# Altium schematic sheet Analogue_Audio.SchDoc: Apalis Evaluation Board 1.1
size A3; Organization: Toradex AG; Address1: Altsagenstrasse 5; Address2: Horw; Address3: 6048; Address4: Switzerland; DocumentNumber: 14; Revision: V1.1; SheetNumber: 14; SheetTotal: 32; PageSetup: Record=PageOptions|CenterHorizontal=True|CenterVertical=True|PrintScale=0.73|XCorrection=1.00|YCorrection=1.00|PrintKind=0|BorderSize=5000000|LeftOffset=0|BottomOffset=0|Orientation=2|PaperLength=1000|PaperWidth=1000|Scale=100|PaperSource=7|PrintQuality=-4|MediaType=1|DitherType=10|PaperKind=A4|PrintScaleMode=1
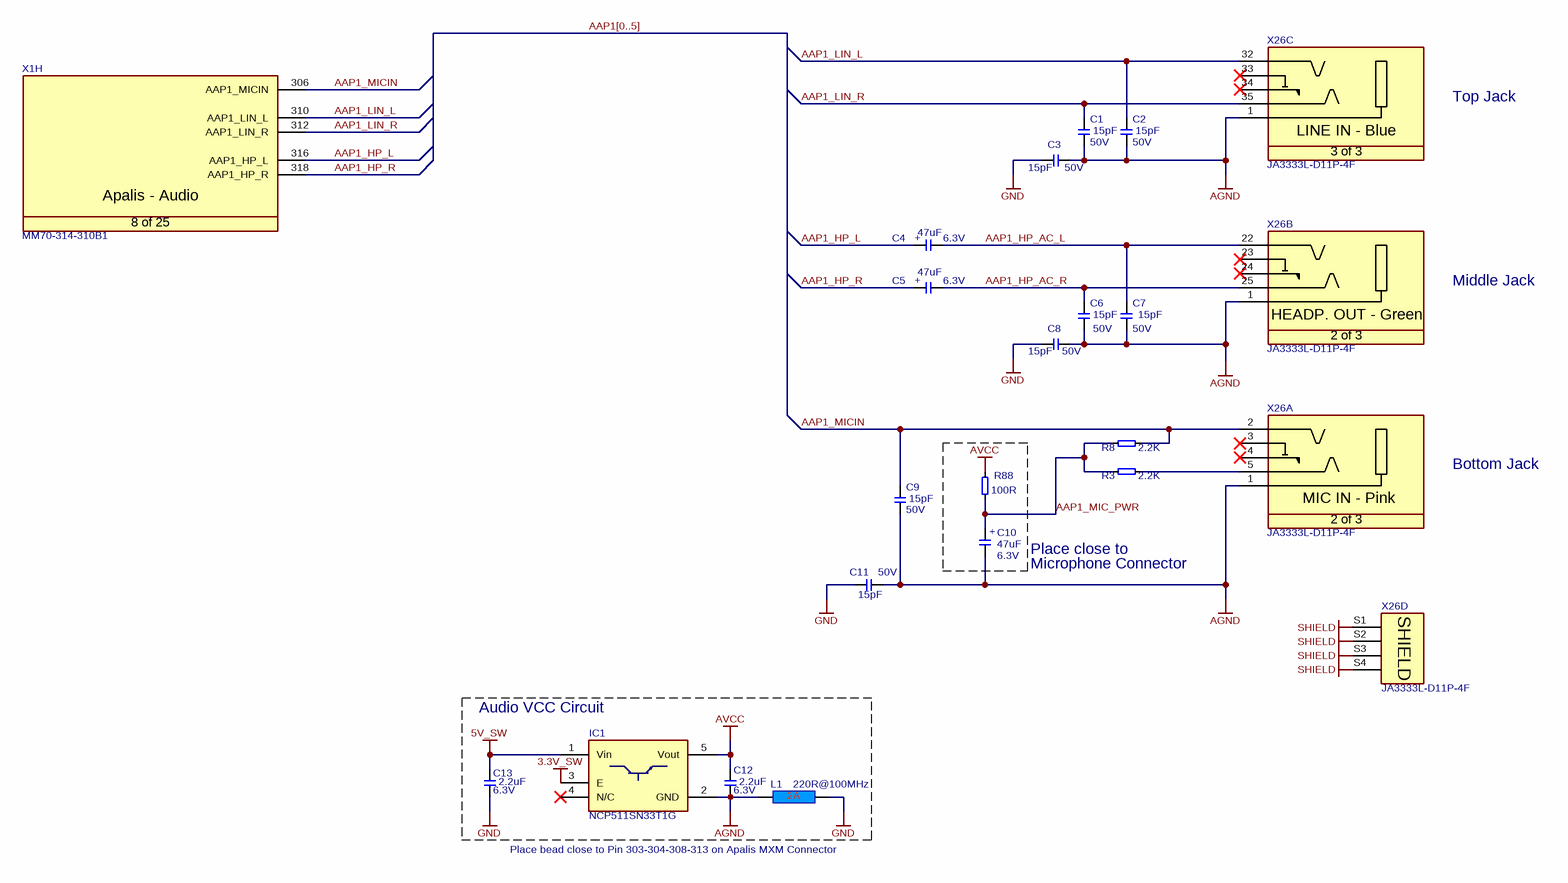
[diagram p0: Analogue_Audio.SchDoc]

## Parts
C1  Rating: 50V  [T_CAPC0603X33N]  (hidden comment: 15pF)
C2  Rating: 50V  [T_CAPC0603X33N]  (hidden comment: 15pF)
C3  Rating: 50V  [T_CAPC0603X33N]  (hidden comment: 15pF)
C4  Rating: 6.3V  [T_CAPMP3216X180N]  (hidden comment: 47uF)
C5  Rating: 6.3V  [T_CAPMP3216X180N]  (hidden comment: 47uF)
C6  Rating: 50V  [T_CAPC0603X33N]  (hidden comment: 15pF)
C7  Rating: 50V  [T_CAPC0603X33N]  (hidden comment: 15pF)
C8  Rating: 50V  [T_CAPC0603X33N]  (hidden comment: 15pF)
C9  Rating: 50V  [T_CAPC0603X33N]  (hidden comment: 15pF)
C10  Rating: 6.3V  [T_CAPMP3216X180N]  (hidden comment: 47uF)
C11  Rating: 50V  [T_CAPC0603X33N]  (hidden comment: 15pF)
C12  Rating: 6.3V  [T_CAPC0603X33N]  (hidden comment: 2.2uF)
C13  Rating: 6.3V  [T_CAPC0603X33N]  (hidden comment: 2.2uF)
IC1  NCP511SN33T1G  [SOT95P279X142-5N]
L1  220R@100MHz  [INDC1608X95N]
R3  2.2K  [T_RESC0603X30N]
R8  2.2K  [T_RESC0603X30N]
R88  100R  [T_RESC0603X30N]
X1  Manufacturer Part No.: MM70-314-310B1  [T_JAE_MM70-314-310B1]  (hidden comment: CON-JAE-MM70-314-310B1-314-0.5mm)  (part H of 25)
X26  JA3333L-D11P-4F  [T_FOXCONN_JA3333L-D11P-4F]  (parts A,B,C,D of 4)

## Blocks framed on the sheet
Audio VCC Circuit: C12 C13 IC1 L1

## Nets
3.3V_SW: IC1.3(E)
5V_SW: C13.2 IC1.1(Vin)
AGND: C1.1 C2.1 C3.2 C6.1 C7.1 C8.2 C9.1 C10.2 C11.1 C12.1 IC1.2(GND) L1.1 X26.1
AVCC: C12.2 IC1.5(Vout) R88.2
GND: C3.1 C8.1 C11.2 C13.1 L1.2
SHIELD: X26.S1(SHIELD) X26.S2(SHIELD) X26.S3(SHIELD) X26.S4(SHIELD)
AAP1_HP_AC_L: C4.2 C7.2 X26.22
AAP1_HP_AC_R: C5.2 C6.2 X26.25
AAP1_HP_L: C4.1 X1.316(AAP1_HP_L)
AAP1_HP_R: C5.1 X1.318(AAP1_HP_R)
AAP1_LIN_L: C2.2 X1.310(AAP1_LIN_L) X26.32
AAP1_LIN_R: C1.2 X1.312(AAP1_LIN_R) X26.35
AAP1_MIC_PWR: C10.1 R3.1 R8.1 R88.1
AAP1_MICIN: C9.2 R8.2 X1.306(AAP1_MICIN) X26.2
NetR3_2: R3.2 X26.5

Not connected (* = marked no-connect by the designer): IC1 4(N/C)*; X26 3* 4* 23* 24* 33* 34*

## Buses and harness runs
bus AAP1[0..5]

## Notes on the sheet
- Top Jack
- Middle Jack
- Bottom Jack
- Place close to
- (near C10) Microphone Connector
- Place bead close to Pin 303-304-308-313 on Apalis MXM Connector
- Title
- Size:
- Date:
- A3
- Number:
- Time:
- Revision:
- Sheet
- of
- File:
- (in symbol C-TA-47uF-6.3V-20%-3216) +
- (in symbol CON-Foxconn-JA3333L-D11P-4F, part A) MIC IN - Pink; 2 of 3
- (in symbol CON-Foxconn-JA3333L-D11P-4F, part B) HEADP. OUT - Green; 2 of 3
- (in symbol CON-Foxconn-JA3333L-D11P-4F, part C) LINE IN - Blue; 3 of 3
- (in symbol CON-JAE-MM70-314-310B1-314-0.5mm, part H) Apalis - Audio; 8 of 25

## Library data of the parts
C1-C3 C6-C9 C11 = C-NPO-15pF-50V-10%-0603: Capacitor Ceramic NPO 15pF 50V 10% 0603; Tolerance: 10%; Type: NPO; Value: 15pF
C4 C5 C10 = C-TA-47uF-6.3V-20%-3216: Capacitor TA 47uF 6.3V 20% 3216; Tolerance: 20%; Type: TA; Value: 47uF
C12 C13 = C-X5R-2.2uF-6.3V-20%-0603: Capacitor Ceramic X5R 2.2uF 6.3V 20% 0603; Tolerance: 20%; Type: X5R; Value: 2.2uF
IC1 = IC-ON-NCP511SN33T1G: NCP511SN33T1G LDO Regulator; Manufacturer Name: ON Semiconductor; Manufacturer Part No.: NCP511SN33T1G
L1 = L-220R@100MHz-2A-25%-0603: 220R@100MHz 2A EMI FILTER; Tolerance: 25%; Rating: 2A; Value: 220R@100MHz
R3 R8 = R-2.2KR-63mW-5%-0603: Resistor 2.2Kohm 63mW 5% 0603; Value: 2.2KR; Rating: 63mW; Tolerance: 5%
R88 = R-100R-63mW-5%-0603: Resistor 100 ohm 63mW 5% 0603; Rating: 63mW; Tolerance: 5%; Value: 100R
X1 = CON-JAE-MM70-314-310B1-314-0.5mm: MXM3 Connector; Manufacturer Name: JAE; No. of ways: 314
X26 = CON-Foxconn-JA3333L-D11P-4F: 3x Audiojack stereo, 3.5mm with sense; No. of ways: 13; Manufacturer Name: Foxconn; Manufacturer Part No.: JA3333L-D11P-4F